# EAGLE schematic Touch-Free Keypad Adaptor rev1.0 (EAGLE 9.4.0)
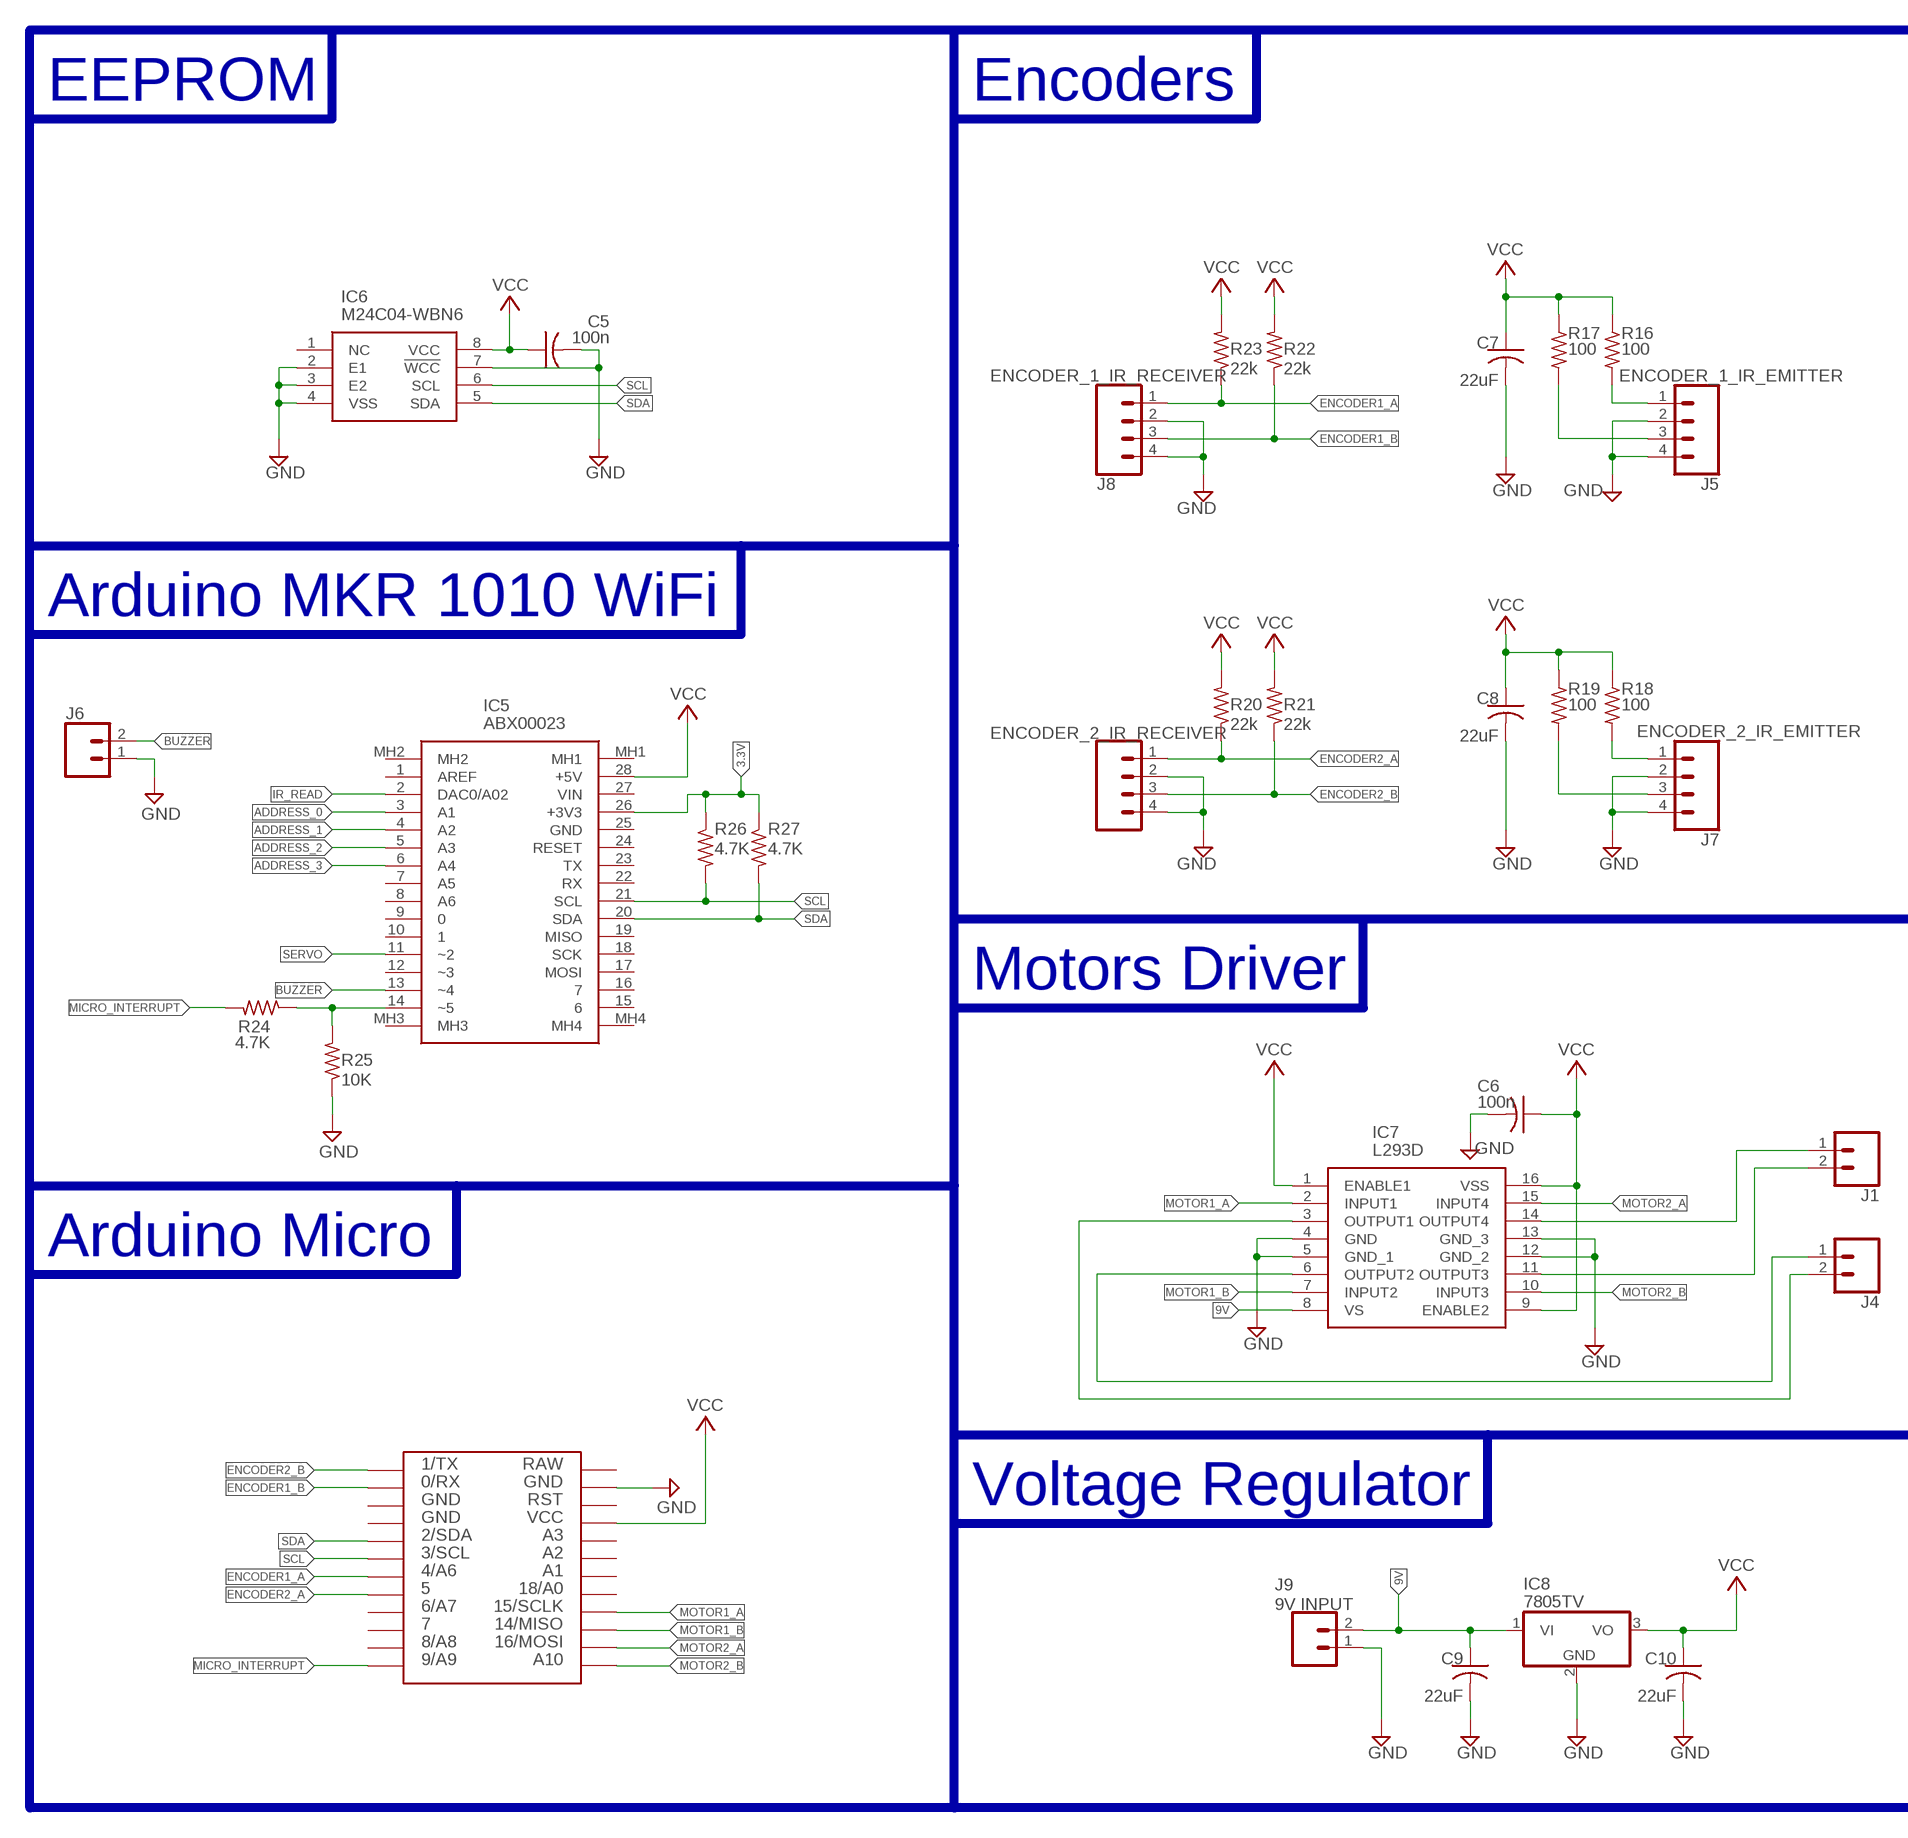
[diagram p0: schematic, sheet 1, part 1 of 2]
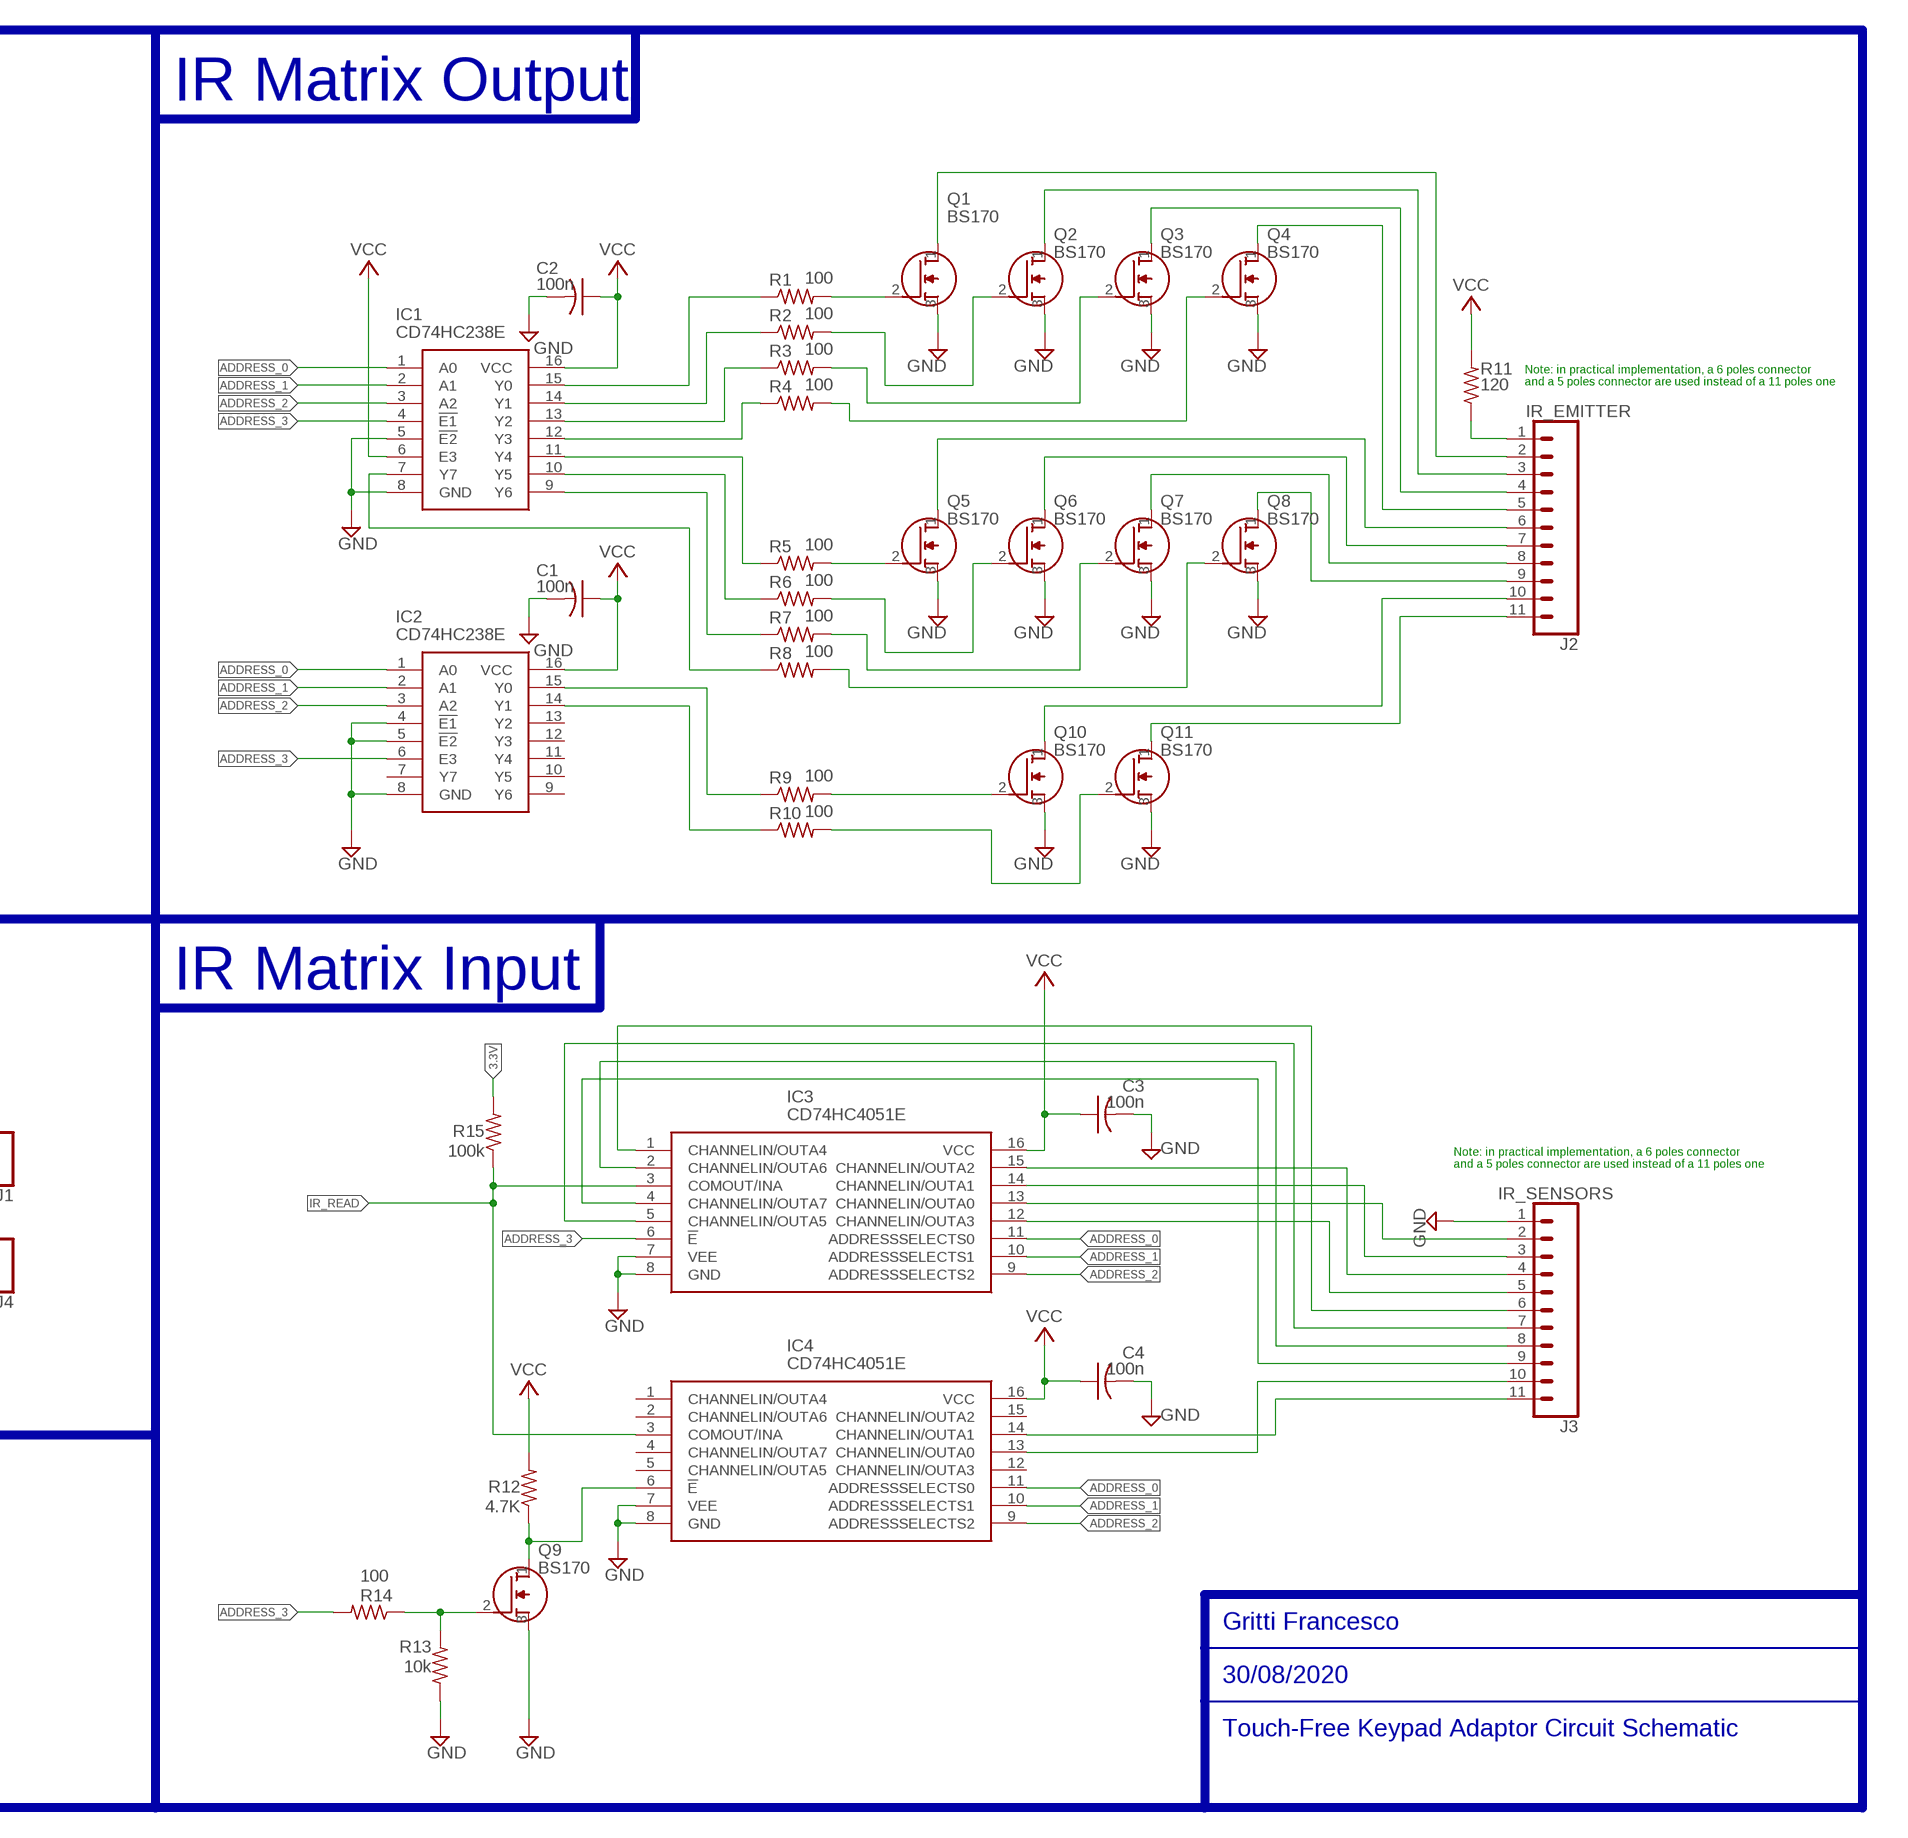
[diagram p1: schematic, sheet 1, part 2 of 2]

## Parts
C1  100n  C-US050-024X044  [C050-024X044]
C2  100n  C-US050-024X044  [C050-024X044]
C3  100n  C-US050-024X044  [C050-024X044]
C4  100n  C-US050-024X044  [C050-024X044]
C5  100n  C-US050-024X044  [C050-024X044]
C6  100n  C-US050-024X044  [C050-024X044]
C7  22uF  C-US050-024X044  [C050-024X044]
C8  22uF  C-US050-024X044  [C050-024X044]
C9  22uF  C-US050-024X044  [C050-024X044]
C10  22uF  C-US050-024X044  [C050-024X044]
ENCODER_2_IR_RECEIVER  CONN_04  [1X04]
IC1  CD74HC238E  [DIP794W53P254L1930H508Q16N]
IC2  CD74HC238E  [DIP794W53P254L1930H508Q16N]
IC3  CD74HC4051E  [DIP794W53P254L1930H508Q16N]
IC4  CD74HC4051E  [DIP794W53P254L1930H508Q16N]
IC5  ABX00023  [ABX00023]
IC6  M24C04-WBN6  [DIP762W56P254L959H533Q8N]
IC7  L293D  [DIP795W50P254L2000H510Q16N]
IC8  7805TV  [TO220V]
J1  CONN_02  [1X02]
J2  IR_EMITTER  CONN_11  [1X11]
J3  IR_SENSORS  CONN_11  [1X11]
J4  CONN_02  [1X02]
J5  ENCODER_1_IR_EMITTER  CONN_04  [1X04]
J6  CONN_02  [1X02]
J7  ENCODER_2_IR_EMITTER  CONN_04  [1X04]
J8  ENCODER_1_IR_RECEIVER  CONN_04  [1X04]
J9  9V INPUT  CONN_025MM  [SCREWTERMINAL-5MM-2]
Q1  BS170  BS170-D27Z  [KA431AZTA]
Q2  BS170  BS170-D27Z  [KA431AZTA]
Q3  BS170  BS170-D27Z  [KA431AZTA]
Q4  BS170  BS170-D27Z  [KA431AZTA]
Q5  BS170  BS170-D27Z  [KA431AZTA]
Q6  BS170  BS170-D27Z  [KA431AZTA]
Q7  BS170  BS170-D27Z  [KA431AZTA]
Q8  BS170  BS170-D27Z  [KA431AZTA]
Q9  BS170  BS170-D27Z  [KA431AZTA]
Q10  BS170  BS170-D27Z  [KA431AZTA]
Q11  BS170  BS170-D27Z  [KA431AZTA]
R1  100  R-US_0207/7  [0207/7]
R2  100  R-US_0207/7  [0207/7]
R3  100  R-US_0207/7  [0207/7]
R4  100  R-US_0207/7  [0207/7]
R5  100  R-US_0207/7  [0207/7]
R6  100  R-US_0207/7  [0207/7]
R7  100  R-US_0207/7  [0207/7]
R8  100  R-US_0207/7  [0207/7]
R9  100  R-US_0207/7  [0207/7]
R10  100  R-US_0207/7  [0207/7]
R11  120  R-US_0207/7  [0207/7]
R12  4.7K  R-US_0207/7  [0207/7]
R13  10k  R-US_0207/7  [0207/7]
R14  100  R-US_0207/7  [0207/7]
R15  100k  R-US_0207/7  [0207/7]
R16  100  R-US_0207/7  [0207/7]
R17  100  R-US_0207/7  [0207/7]
R18  100  R-US_0207/7  [0207/7]
R19  100  R-US_0207/7  [0207/7]
R20  22k  R-US_0207/7  [0207/7]
R21  22k  R-US_0207/7  [0207/7]
R22  22k  R-US_0207/7  [0207/7]
R23  22k  R-US_0207/7  [0207/7]
R24  4.7K  R-US_0207/7  [0207/7]
R25  10K  R-US_0207/7  [0207/7]
R26  4.7K  R-US_0207/7  [0207/7]
R27  4.7K  R-US_0207/7  [0207/7]
U$31  ARDUINO_MICRO  [ARDUINO_MICRO]

## Nets
3.3V: IC5.26(+3V3) R15.2 R26.1 R27.1
9V: C9.1 IC7.8(VS) IC8.1(VI) J9.2
ADDRESS_0: IC1.1(A0) IC2.1(A0) IC3.11(ADDRESSSELECTS0) IC4.11(ADDRESSSELECTS0) IC5.3(A1)
ADDRESS_1: IC1.2(A1) IC2.2(A1) IC3.10(ADDRESSSELECTS1) IC4.10(ADDRESSSELECTS1) IC5.4(A2)
ADDRESS_2: IC1.3(A2) IC2.3(A2) IC3.9(ADDRESSSELECTS2) IC4.9(ADDRESSSELECTS2) IC5.5(A3)
ADDRESS_3: IC1.4(!E1) IC2.6(E3) IC3.6(!E) IC5.6(A4) R14.2
BUZZER: IC5.13(~4) J6.2
ENCODER1_A: J8.1 R23.1 U$31.P$7
ENCODER1_B: J8.3 R22.1 U$31.P$2
ENCODER2_A: ENCODER_2_IR_RECEIVER.1 R20.1 U$31.P$8
ENCODER2_B: ENCODER_2_IR_RECEIVER.3 R21.1 U$31.P$1
GND: C1.2 C2.2 C3.2 C4.2 C5.2 C6.2 C7.2 C8.2 C9.2 C10.2 ENCODER_2_IR_RECEIVER.2 ENCODER_2_IR_RECEIVER.4 IC1.5(!E2) IC1.8(GND) IC2.4(!E1) IC2.5(!E2) IC2.8(GND) IC3.7(VEE) IC3.8(GND) IC4.7(VEE) IC4.8(GND) IC6.2(E1) IC6.3(E2) IC6.4(VSS) IC6.7(!WCC) IC7.4(GND) IC7.5(GND_1) IC7.12(GND_2) IC7.13(GND_3) IC8.2(GND) J3.1 J5.2 J5.4 J6.1 J7.2 J7.4 J8.2 J8.4 J9.1 Q1.3(S) Q2.3(S) Q3.3(S) Q4.3(S) Q5.3(S) Q6.3(S) Q7.3(S) Q8.3(S) Q9.3(S) Q10.3(S) Q11.3(S) R13.1 R25.1 U$31.P$23
IR_READ: IC3.3(COMOUT/INA) IC4.3(COMOUT/INA) IC5.2(DAC0/A02) R15.1
MICRO_INTERRUPT: R24.2 U$31.P$12
MOTOR1_A: IC7.2(INPUT1) U$31.P$16
MOTOR1_B: IC7.7(INPUT2) U$31.P$15
MOTOR2_A: IC7.15(INPUT4) U$31.P$14
MOTOR2_B: IC7.10(INPUT3) U$31.P$13
N$1: J2.5 Q4.1(D)
N$2: J2.4 Q3.1(D)
N$3: J2.3 Q2.1(D)
N$4: J2.2 Q1.1(D)
N$5: J2.11 Q11.1(D)
N$6: J2.8 Q7.1(D)
N$7: J2.7 Q6.1(D)
N$8: J2.6 Q5.1(D)
N$9: J2.10 Q10.1(D)
N$10: J2.9 Q8.1(D)
N$11: Q4.2(G) R4.2
N$12: Q3.2(G) R3.2
N$13: Q2.2(G) R2.2
N$14: Q1.2(G) R1.2
N$15: Q5.2(G) R5.2
N$16: Q8.2(G) R8.2
N$17: Q7.2(G) R7.2
N$18: Q6.2(G) R6.2
N$19: Q10.2(G) R9.2
N$20: Q11.2(G) R10.2
N$21: IC1.15(Y0) R1.1
N$22: IC1.14(Y1) R2.1
N$23: IC1.13(Y2) R3.1
N$24: IC1.12(Y3) R4.1
N$25: IC1.11(Y4) R5.1
N$26: IC1.10(Y5) R6.1
N$27: IC1.9(Y6) R7.1
N$28: IC1.7(Y7) R8.1
N$29: IC2.15(Y0) R9.1
N$30: IC2.14(Y1) R10.1
N$31: J2.1 R11.1
N$32: IC3.13(CHANNELIN/OUTA0) J3.2
N$33: IC3.14(CHANNELIN/OUTA1) J3.3
N$34: IC3.15(CHANNELIN/OUTA2) J3.4
N$35: IC3.12(CHANNELIN/OUTA3) J3.5
N$36: IC3.1(CHANNELIN/OUTA4) J3.6
N$37: IC3.5(CHANNELIN/OUTA5) J3.7
N$38: IC3.2(CHANNELIN/OUTA6) J3.8
N$39: IC3.4(CHANNELIN/OUTA7) J3.9
N$40: IC4.13(CHANNELIN/OUTA0) J3.10
N$41: IC4.14(CHANNELIN/OUTA1) J3.11
N$42: J7.1 R18.2
N$43: IC4.6(!E) Q9.1(D) R12.1
N$44: Q9.2(G) R13.2 R14.1
N$45: IC7.14(OUTPUT4) J1.1
N$46: IC7.11(OUTPUT3) J1.2
N$47: IC7.6(OUTPUT2) J4.1
N$48: IC7.3(OUTPUT1) J4.2
N$49: J5.1 R16.2
N$50: J5.3 R17.2
N$52: J7.3 R19.2
N$53: IC5.14(~5) R24.1 R25.2
SCL: IC5.21(SCL) IC6.6(SCL) R26.2 U$31.P$6
SDA: IC5.20(SDA) IC6.5(SDA) R27.2 U$31.P$5
SERVO: IC5.11(~2)
VCC: C1.1 C2.1 C3.1 C4.1 C5.1 C7.1 C8.1 C10.1 IC1.6(E3) IC1.16(VCC) IC2.16(VCC) IC3.16(VCC) IC4.16(VCC) IC5.28(+5V) IC6.8(VCC) IC7.1(ENABLE1) IC7.9(ENABLE2) IC7.16(VSS) IC8.3(VO) R11.2 R12.2 R16.1 R17.1 R18.1 R19.1 R20.2 R21.2 R22.2 R23.2 U$31.P$21
VCC1: C6.1
Unconnected: IC2.7(Y7) IC2.9(Y6) IC2.10(Y5) IC2.11(Y4) IC2.12(Y3) IC2.13(Y2) IC4.1(CHANNELIN/OUTA4) IC4.2(CHANNELIN/OUTA6) IC4.4(CHANNELIN/OUTA7) IC4.5(CHANNELIN/OUTA5) IC4.12(CHANNELIN/OUTA3) IC4.15(CHANNELIN/OUTA2) IC5.1(AREF) IC5.7(A5) IC5.8(A6) IC5.9 IC5.10 IC5.12(~3) IC5.15 IC5.16 IC5.17(MOSI) IC5.18(SCK) IC5.19(MISO) IC5.22(RX) IC5.23(TX) IC5.24(RESET) IC5.25(GND) IC5.27(VIN) IC5.MH1 IC5.MH2 IC5.MH3 IC5.MH4 IC6.1(NC) U$31.P$3 U$31.P$4 U$31.P$9 U$31.P$10 U$31.P$11 U$31.P$17 U$31.P$18 U$31.P$19 U$31.P$20 U$31.P$22 U$31.P$24

## Notes on the sheet
- EEPROM | Encoders | IR Matrix Output
- Note: in practical implementation, a 6 poles connector
  and a 5 poles connector are used instead of a 11 poles one
- Arduino MKR 1010 WiFi
- Motors Driver | IR Matrix Input
- Note: in practical implementation, a 6 poles connector
  and a 5 poles connector are used instead of a 11 poles one
- Arduino Micro
- Voltage Regulator
- Gritti Francesco
- 30/08/2020
- Touch-Free Keypad Adaptor Circuit Schematic

## Library data of the parts
C1-C10 = adafruit:C-US: CAPACITOR, American symbol
ENCODER_2_IR_RECEIVER J5 J7 J8 = SparkFun-Connectors:CONN_04: Multi connection point. Often used as Generic Header-pin footprint for 0.1 inch spaced/style header connections On any of the 0.1 inch spaced packages, you can populate with these: Break Away Headers - Straight <https://www.sparkfun.com/products/116> (PRT-00116) Break Away Male Headers - Right Angle <https://www.sparkfun.com/products/553> (PRT-00553) Female Headers <https://www.sparkfun.com/products/115> (PRT-00115) Break Away Headers - Machine Pin <https://www.sparkfun.com/products/117> (PRT-00117) Break Away Female Headers - Swiss Machine Pin <https://www.sparkfun.com/products/743> (PRT-00743) For SCREWTERMINALS and SPRING TERMINALS visit here: Screw Terimnals on SparkFun.com <https://www.sparkfun.com/search/results?term=Screw+Terminals> (5mm/3.5mm/2.54mm spacing) This device is also useful as a general connection point to wire up your design to another part of your project. Our various solder wires solder well into these plated through hole pads. Hook-Up Wire - Assortment (Stranded, 22 AWG) <https://www.sparkfun.com/products/11375> (PRT-11375) Hook-Up Wire - Assortment (Solid Core, 22 AWG) <https://www.sparkfun.com/products/11367> (PRT-11367) View the entire wire category on our website here <https://www.sparkfun.com/categories/141> Special notes: Molex polarized connector foot print use with SKU : PRT-08231 with associated crimp pins and housings. 1MM SMD Version SKU: PRT-10208; PROD_ID: CONN-09696
IC1 IC2 = SamacSys_Parts:CD74HC238E: High Speed CMOS Logic 3-to-8 Line Decoder Demultiplexer Inverting and Non-Inverting Source: Datasheet <http://www.ti.com/lit/gpn/cd74hc238>; ARROW_PART_NUMBER: CD74HC238E; ARROW_PRICE-STOCK: https://www.arrow.com/en/products/cd74hc238e/texas-instruments; DESCRIPTION: High Speed CMOS Logic 3-to-8 Line Decoder Demultiplexer Inverting and Non-Inverting; HEIGHT: 5.08mm; MANUFACTURER_NAME: Texas Instruments; MANUFACTURER_PART_NUMBER: CD74HC238E; MOUSER_PART_NUMBER: 595-CD74HC238E; MOUSER_PRICE-STOCK: https://www.mouser.co.uk/ProductDetail/Texas-Instruments/CD74HC238E?qs=xFfolx0DHx2djOhmdGyl2g%3D%3D
IC3 IC4 = SamacSys_Parts:CD74HC4051E: CD74HC4051E, Multiplexer/Demultiplexer Single 8:1, 3 V, 5 V, 16-Pin, PDIP, 1 Source: Datasheet <http://www.ti.com/lit/ds/symlink/cd74hc4051.pdf>; ARROW_PART_NUMBER: CD74HC4051E; ARROW_PRICE-STOCK: https://www.arrow.com/en/products/cd74hc4051e/texas-instruments; DESCRIPTION: CD74HC4051E, Multiplexer/Demultiplexer Single 8:1, 3 V, 5 V, 16-Pin, PDIP, 1; HEIGHT: 5.08mm; MANUFACTURER_NAME: Texas Instruments; MANUFACTURER_PART_NUMBER: CD74HC4051E; MOUSER_PART_NUMBER: 595-CD74HC4051E; MOUSER_PRICE-STOCK: https://www.mouser.co.uk/ProductDetail/Texas-Instruments/CD74HC4051E?qs=LfG3tU9ud8CbsH7xUrF9XA%3D%3D
IC5 = SamacSys_Parts:ABX00023: ARDUINO MKR WIFI 1010 Source: Datasheet <https://store.arduino.cc/arduino-mkr-wifi-1010>; ARROW_PART_NUMBER: ABX00023; ARROW_PRICE-STOCK: https://www.arrow.com/en/products/abx00023/arduino-corporation; DESCRIPTION: ARDUINO MKR WIFI 1010; HEIGHT: 3mm; MANUFACTURER_NAME: Arduino; MANUFACTURER_PART_NUMBER: ABX00023; MOUSER_PART_NUMBER: 782-ABX00023; MOUSER_PRICE-STOCK: https://www.mouser.co.uk/ProductDetail/Arduino/ABX00023?qs=%252BEew9%252B0nqrAwxv2YQYWyPw%3D%3D
IC6 = SamacSys_Parts:M24C04-WBN6: M24C04-WBN6, Serial EEPROM Memory 4kbit, Serial-I2C, 900ns 2.5 5.5 V, 8-Pin PDIP Source: Datasheet <http://www.st.com/st-web-ui/static/active/en/resource/technical/document/datasheet/DM00071277.pdf>; ARROW_PART_NUMBER: M24C04-WBN6; DESCRIPTION: M24C04-WBN6, Serial EEPROM Memory 4kbit, Serial-I2C, 900ns 2.5 5.5 V, 8-Pin PDIP; HEIGHT: 5.33mm; MANUFACTURER_NAME: STMicroelectronics; MANUFACTURER_PART_NUMBER: M24C04-WBN6; MOUSER_PART_NUMBER: 511-M24C04-WBN6; MOUSER_PRICE-STOCK: https://www.mouser.co.uk/ProductDetail/STMicroelectronics/M24C04-WBN6?qs=ufngUjGJi9KMRedpFGrcKQ%3D%3D
IC7 = SamacSys_Parts:L293D: L293D, Motor Driver, 4.5 36 V, 16-Pin Power PDIP Source: Datasheet <http://www.st.com/web/en/resource/technical/document/datasheet/CD00000059.pdf>; ALLIED_NUMBER: 70014167; ALLIED_PRICE-STOCK: http://www.alliedelec.com/stmicroelectronics-l293d/70014167/; DESCRIPTION: L293D, Motor Driver, 4.5 36 V, 16-Pin Power PDIP; HEIGHT: 5.1mm; MANUFACTURER_NAME: STMicroelectronics; MANUFACTURER_PART_NUMBER: L293D; MOUSER_PART_NUMBER: 511-L293D; MOUSER_PRICE-STOCK: https://www.mouser.com/Search/Refine.aspx?Keyword=511-L293D; RS_PART_NUMBER: 7140622P; RS_PRICE-STOCK: http://uk.rs-online.com/web/p/products/7140622P
IC8 = linear:78*: Positive VOLTAGE REGULATOR Source: http://cache.national.com/ds/LM/LM78L05.pdf http://www.fairchildsemi.com/ds/LM/LM7805.pdf
J1 J4 J6 = SparkFun-Connectors:CONN_02: Multi connection point. Often used as Generic Header-pin footprint for 0.1 inch spaced/style header connections On any of the 0.1 inch spaced packages, you can populate with these: Break Away Headers - Straight <https://www.sparkfun.com/products/116> (PRT-00116) Break Away Male Headers - Right Angle <https://www.sparkfun.com/products/553> (PRT-00553) Female Headers <https://www.sparkfun.com/products/115> (PRT-00115) Break Away Headers - Machine Pin <https://www.sparkfun.com/products/117> (PRT-00117) Break Away Female Headers - Swiss Machine Pin <https://www.sparkfun.com/products/743> (PRT-00743) For SCREWTERMINALS and SPRING TERMINALS visit here: Screw Terimnals on SparkFun.com <https://www.sparkfun.com/search/results?term=Screw+Terminals> (5mm/3.5mm/2.54mm spacing) This device is also useful as a general connection point to wire up your design to another part of your project. Our various solder wires solder well into these plated through hole pads. Hook-Up Wire - Assortment (Stranded, 22 AWG) <https://www.sparkfun.com/products/11375> (PRT-11375) Hook-Up Wire - Assortment (Solid Core, 22 AWG) <https://www.sparkfun.com/products/11367> (PRT-11367) View the entire wire category on our website here <https://www.sparkfun.com/categories/141> Special notes: Molex polarized connector foot print use with: PRT-08233 with associated crimp pins and housings. 2.54_SCREWTERM for use with PRT-10571. 3.5mm Screw Terminal footprints for PRT-08084 5mm Screw Terminal footprints for use with PRT-08432
J2 J3 = SparkFun-Connectors:CONN_11: Multi connection point. Often used as Generic Header-pin footprint for 0.1 inch spaced/style header connections On any of the 0.1 inch spaced packages, you can populate with these: Break Away Headers - Straight <https://www.sparkfun.com/products/116> (PRT-00116) Break Away Male Headers - Right Angle <https://www.sparkfun.com/products/553> (PRT-00553) Female Headers <https://www.sparkfun.com/products/115> (PRT-00115) Break Away Headers - Machine Pin <https://www.sparkfun.com/products/117> (PRT-00117) Break Away Female Headers - Swiss Machine Pin <https://www.sparkfun.com/products/743> (PRT-00743) For SCREWTERMINALS and SPRING TERMINALS visit here: Screw Terimnals on SparkFun.com <https://www.sparkfun.com/search/results?term=Screw+Terminals> (5mm/3.5mm/2.54mm spacing) This device is also useful as a general connection point to wire up your design to another part of your project. Our various solder wires solder well into these plated through hole pads. Hook-Up Wire - Assortment (Stranded, 22 AWG) <https://www.sparkfun.com/products/11375> (PRT-11375) Hook-Up Wire - Assortment (Solid Core, 22 AWG) <https://www.sparkfun.com/products/11367> (PRT-11367) View the entire wire category on our website here <https://www.sparkfun.com/categories/141>
J9 = SparkFun-Connectors:CONN_02: Multi connection point. Often used as Generic Header-pin footprint for 0.1 inch spaced/style header connections On any of the 0.1 inch spaced packages, you can populate with these: Break Away Headers - Straight <https://www.sparkfun.com/products/116> (PRT-00116) Break Away Male Headers - Right Angle <https://www.sparkfun.com/products/553> (PRT-00553) Female Headers <https://www.sparkfun.com/products/115> (PRT-00115) Break Away Headers - Machine Pin <https://www.sparkfun.com/products/117> (PRT-00117) Break Away Female Headers - Swiss Machine Pin <https://www.sparkfun.com/products/743> (PRT-00743) For SCREWTERMINALS and SPRING TERMINALS visit here: Screw Terimnals on SparkFun.com <https://www.sparkfun.com/search/results?term=Screw+Terminals> (5mm/3.5mm/2.54mm spacing) This device is also useful as a general connection point to wire up your design to another part of your project. Our various solder wires solder well into these plated through hole pads. Hook-Up Wire - Assortment (Stranded, 22 AWG) <https://www.sparkfun.com/products/11375> (PRT-11375) Hook-Up Wire - Assortment (Solid Core, 22 AWG) <https://www.sparkfun.com/products/11367> (PRT-11367) View the entire wire category on our website here <https://www.sparkfun.com/categories/141> Special notes: Molex polarized connector foot print use with: PRT-08233 with associated crimp pins and housings. 2.54_SCREWTERM for use with PRT-10571. 3.5mm Screw Terminal footprints for PRT-08084 5mm Screw Terminal footprints for use with PRT-08432; SF_SKU: PRT-08432
Q1-Q11 = SamacSys_Parts:BS170-D27Z: MOSFET N-Ch Enhancement Mode Field Effect Source: Datasheet <https://componentsearchengine.com/Datasheets/2/BS170-D27Z.pdf>; ARROW_PART_NUMBER: BS170-D27Z; DESCRIPTION: MOSFET N-Ch Enhancement Mode Field Effect; HEIGHT: 5.33mm; MANUFACTURER_NAME: ON Semiconductor; MANUFACTURER_PART_NUMBER: BS170-D27Z; MOUSER_PART_NUMBER: 512-BS170D27Z; MOUSER_PRICE-STOCK: https://www.mouser.co.uk/ProductDetail/ON-Semiconductor-Fairchild/BS170-D27Z?qs=0lQeLiL1qybtYouixLcZzA%3D%3D
R1-R18 R20-R27 = adafruit:R-US_: RESISTOR, American symbol
R19 = adafruit:R-US_: RESISTOR, American symbol; SPICEPREFIX: R
U$31 = Arduino_Micro:ARDUINO_MICRO